# Altium project Genasun_Wattmeter.PrjPcb
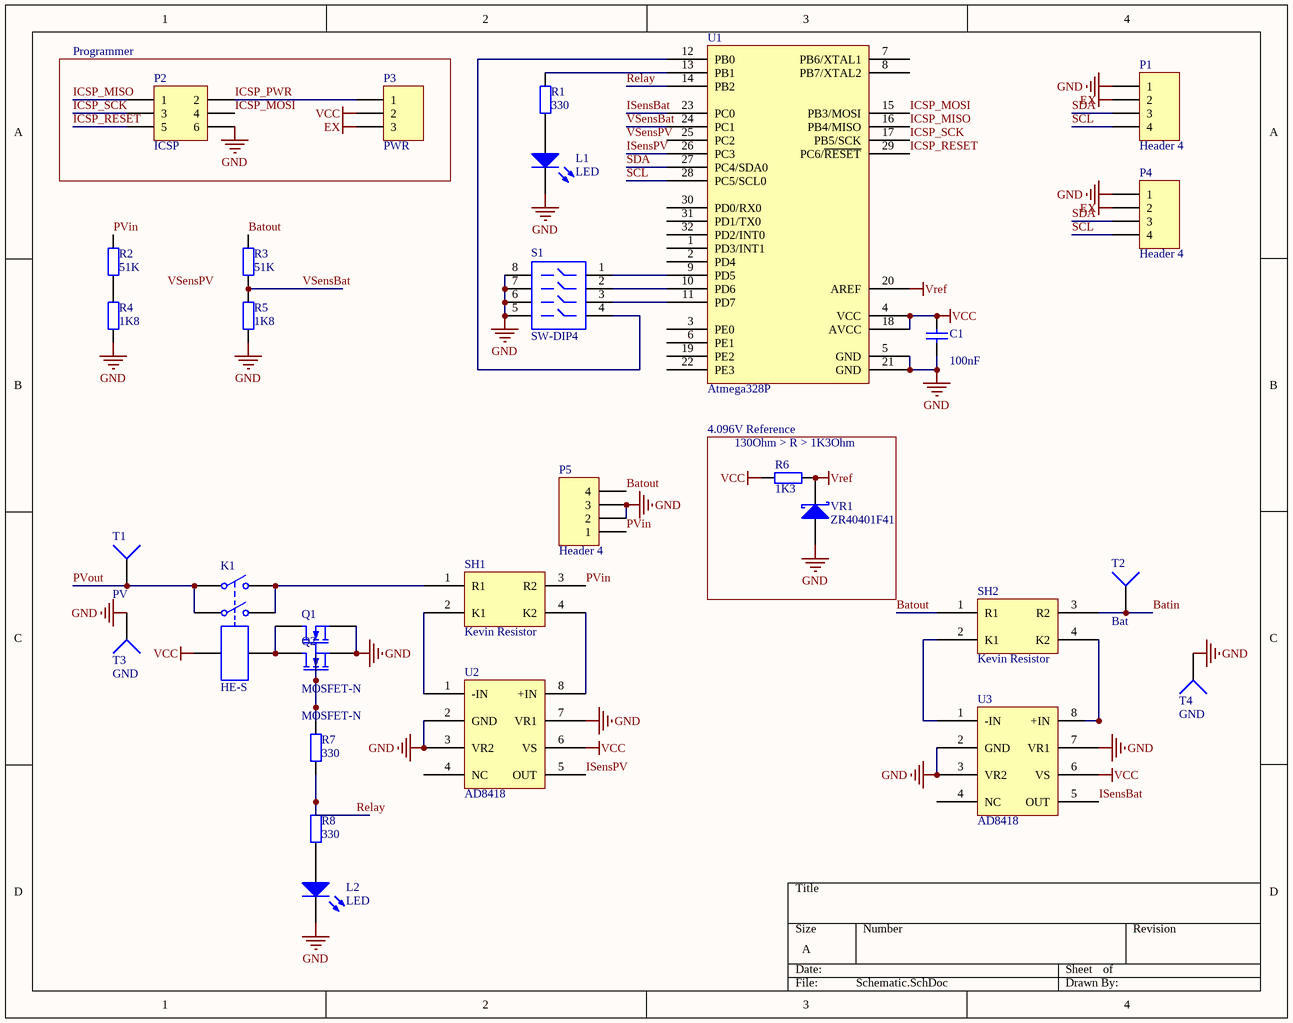
[diagram p0: Schematic.SchDoc]
1 sheet, 30 parts. Net scope: global (net labels, ports and power ports of the same name join across sheets).
Board file: PCB.PcbDoc

## Sheet Schematic.SchDoc
size A

### Parts
C1  value 100nF  [CAP 0805/2012]  (hidden comment: Cap)
K1  HE-S  [Relay HE-S Parasonic]
L1  LED  [LED 0805/2012 RED]
L2  LED  [LED 0805/2012 RED]
P1  Header 4  [TE 282834-4]
P2  ICSP  [HDR2X3]
P3  PWR  [HDR1X3]
P4  Header 4  [TE 282834-4]
P5  Header 4  [4Pin 6.35mm Connector]
Q1  MOSFET-N  [SOT23_N]
Q2  MOSFET-N  [SOT23_N]
R1  value 330  [RES 0805/2012]  (hidden comment: Res2)
R2  value 51K  [RES 0805/2012]  (hidden comment: Res2)
R3  value 51K  [RES 0805/2012]  (hidden comment: Res2)
R4  value 1K8  [RES 0805/2012]  (hidden comment: Res2)
R5  value 1K8  [RES 0805/2012]  (hidden comment: Res2)
R6  value 1K3  [RES 0805/2012]  (hidden comment: Res2)
R7  value 330  [RES 0805/2012]  (hidden comment: Res2)
R8  value 330  [RES 0805/2012]  (hidden comment: Res2)
S1  SW-DIP4  [CTS 218-4LPJ]
SH1  Kevin Resistor  [TE TLR Shunt]
SH2  Kevin Resistor  [TE TLR Shunt]
T1  PV  [PCB_Pin_Outsteeksel]
T2  Bat  [PCB_Pin_Outsteeksel]
T3  GND  [PCB_Pin_Outsteeksel]
T4  GND  [PCB_Pin_Outsteeksel]
U1  Atmega328P  [ST LQFP-32 7X7MM]
U2  AD8418  [ANALOG MSOP-8 RM-8]
U3  AD8418  [ANALOG MSOP-8 RM-8]
VR1  ZR40401F41  [DIODES SOT-23-3]

### Blocks framed on the sheet
Programmer: P2 P3

### Nets
EX: P1.2 P3.3 P4.2
GND: C1.1 L1.2(K) L2.2(K) P1.1 P2.6 P4.1 P5.2 P5.3 Q1.2(S) Q2.2(S) R4.1 R5.1 S1.5 S1.6 S1.7 S1.8 T3.1 T4.1 U1.5(GND) U1.21(GND) U2.2(GND) U2.3(VR2) U2.7(VR1) U3.2(GND) U3.3(VR2) U3.7(VR1) VR1.3(A)
VCC: C1.2 K1.5 P3.2 R6.2 U1.4(VCC) U1.18(AVCC) U2.6(VS) U3.6(VS)
Vref: R6.1 U1.20(AREF) VR1.1(K)
Batin: SH2.3(R2) T2.1
Batout: P5.4 R3.2 SH2.1(R1)
ICSP_MISO: P2.1 U1.16(PB4/MISO)
ICSP_MOSI: P2.4 U1.15(PB3/MOSI)
ICSP_PWR: P2.2 P3.1
ICSP_RESET: P2.5 U1.29(PC6/~{RESET})
ICSP_SCK: P2.3 U1.17(PB5/SCK)
ISensBat: U1.23(PC0) U3.5(OUT)
ISensPV: U1.26(PC3) U2.5(OUT)
PVin: P5.1 R2.2 SH1.3(R2)
PVout: K1.1 K1.3 T1.1
Relay: R7.2 R8.2 U1.14(PB2)
SCL: P1.4 P4.4 U1.28(PC5/SCL0)
SDA: P1.3 P4.3 U1.27(PC4/SDA0)
VSensBat: R3.1 R5.2 U1.24(PC1)
NetK1_2: K1.2 K1.4 SH1.1(R1)
NetK1_6: K1.6 Q1.1(D) Q2.1(D)
NetL1_1: L1.1(A) R1.1
NetL2_1: L2.1(A) R8.1
NetQ1_3: Q1.3(G) Q2.3(G) R7.1
NetR1_2: R1.2 U1.13(PB1)
NetR2_1: R2.1 R4.2
NetS1_1: S1.1 U1.9(PD5)
NetS1_2: S1.2 U1.10(PD6)
NetS1_3: S1.3 U1.11(PD7)
NetS1_4: S1.4 U1.12(PB0)
NetSH1_2: SH1.2(K1) U2.1(-IN)
NetSH1_4: SH1.4(K2) U2.8(+IN)
NetSH2_2: SH2.2(K1) U3.1(-IN)
NetSH2_4: SH2.4(K2) U3.8(+IN)

Not connected (* = marked no-connect by the designer): U1 1(PD3/INT1) 2(PD4) 3(PE0) 6(PE1) 7(PB6/XTAL1) 8(PB7/XTAL2) 19(PE2) 22(PE3) 25(PC2) 30(PD0/RX0) 31(PD1/TX0) 32(PD2/INT0); U2 4(NC); U3 4(NC)

### Notes on the sheet
- 4.096V Reference
- (near R6) 130Ohm > R > 1K3Ohm
- Labels drawn without touching a wire or pin: VSensPV

### Library data of the parts
C1 = Cap: Capacitor; Published: 8-Jun-2000; LatestRevisionDate: 17-Jul-2002; LatestRevisionNote: Re-released for DXP Platform.; PackageReference: RAD-0.3; Publisher: Altium Limited; PackageDescription: Radial Cap, Thru-Hole; 2 Leads; 0.3 in Pin Spacing
K1 = Relay-DPST: Dual-Pole Single-Throw Relay; pin to pad: 2>7 3>2 4>8 5>4 6>5; Published: 24-Mar-1999; LatestRevisionDate: 17-Jul-2002; LatestRevisionNote: Re-released for DXP Platform.; PackageReference: MODULE6; Publisher: Altium Limited
L1 L2 = LED0: Typical INFRARED GaAs LED; Published: 8-Jun-2000; LatestRevisionDate: 08-Jul-2005; LatestRevisionNote: Mech Layer 1 removed.; PackageReference: LED-0; Publisher: Altium Limited; PackageDescription: LED; 2 Leads
P1 P4 P5 = Header 4: Header, 4-Pin; LatestRevisionDate: 17-Jul-2002; LatestRevisionNote: Re-released for DXP Platform.; Publisher: Altium Limited
P2 = Header 3X2: Header, 3-Pin, Dual row; LatestRevisionDate: 17-Jul-2002; LatestRevisionNote: Re-released for DXP Platform.; Publisher: Altium Limited
P3 = Header 3: Header, 3-Pin; LatestRevisionDate: 17-Jul-2002; LatestRevisionNote: Re-released for DXP Platform.; Publisher: Altium Limited
Q1 Q2 = MOSFET-N: N-Channel MOSFET; Published: 8-Jun-2000; LatestRevisionDate: 17-Jul-2002; LatestRevisionNote: Re-released for DXP Platform.; PackageVersion: 1995/1996; PackageReference: E3; Publisher: Altium Limited; PackageDescription: TO, Flat Index; 3 In-Line, Axial Leads; Body Dia. 4.6mm; Lead Dia. 0.5 mm (max)
R1-R8 = Res2: Resistor; Published: 8-Jun-2000; LatestRevisionDate: 17-Jul-2002; LatestRevisionNote: Re-released for DXP Platform.; PackageReference: AXIAL-0.4; Publisher: Altium Limited; PackageDescription: Axial Device, Thru-Hole; 2 Leads; 0.4 in Pin Spacing
S1 = SW-DIP4: DIP Switch; Published: 24-Mar-1999; LatestRevisionDate: 17-Jul-2002; LatestRevisionNote: Re-released for DXP Platform.; PackageReference: DIP-8; Publisher: Altium Limited
T1-T4 = Socket: LatestRevisionDate: 17-Jul-2002; LatestRevisionNote: Re-released for DXP Platform.; Publisher: Altium Limited
VR1 = Diode 10TQ035: Schottky Rectifier; Note: Terminal 2 is the TAB and is electrically connected to the cathode; Published: 8-Jun-2000; LatestRevisionDate: 17-Jul-2002; LatestRevisionNote: Re-released for DXP Platform.; DatasheetVersion: PD-2.057B; PackageVersion: Feb-1998; PackageReference: TO-220AC; Publisher: Altium Limited; PackageDescription: TO, Thru-Hole, Vertical, Heatsink Mounted; 3 In-Line Leads (1 Absent); Pitch 2.54 mm; ComponentLink1Description: Manufacturer Link; ComponentLink1URL: http://www.irf.com/; ComponentLink2Description: Datasheet; ComponentLink2URL: http://www.irf.com/product-info/datasheets/data/10tq.pdf